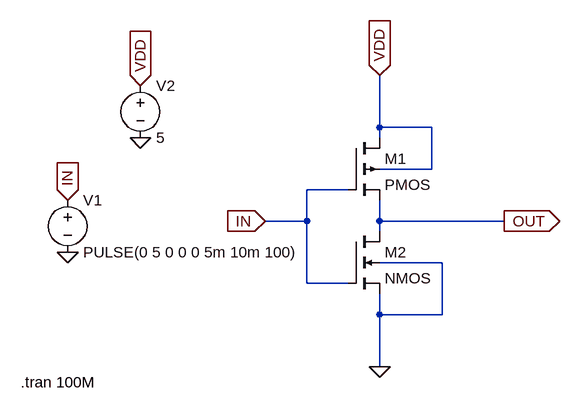
[diagram p0: schematic Schematic.asc]
Schematic.asc, the LTspice schematic file:
Version 4
SHEET 1 880 680
WIRE 208 16 208 -64
WIRE 288 16 208 16
WIRE 208 32 208 16
WIRE 288 80 288 16
WIRE 288 80 208 80
WIRE 160 112 96 112
WIRE 96 160 96 112
WIRE 96 160 32 160
WIRE 208 160 208 128
WIRE 400 160 208 160
WIRE 208 176 208 160
WIRE 304 224 208 224
WIRE 96 256 96 160
WIRE 160 256 96 256
WIRE 208 304 208 272
WIRE 304 304 304 224
WIRE 304 304 208 304
WIRE 208 384 208 304
FLAG 208 384 0
FLAG 32 160 IN
IOPIN 32 160 In
FLAG 400 160 OUT
IOPIN 400 160 Out
FLAG 208 -64 VDD
IOPIN 208 -64 In
FLAG -160 -48 VDD
IOPIN -160 -48 In
FLAG -272 128 IN
IOPIN -272 128 In
FLAG -160 32 0
FLAG -272 208 0
SYMBOL pmos4 160 32 R0
SYMATTR InstName M1
SYMBOL nmos4 160 176 R0
SYMATTR InstName M2
SYMBOL voltage -272 112 R0
WINDOW 123 0 0 Left 0
WINDOW 39 0 0 Left 0
SYMATTR InstName V1
SYMATTR Value PULSE(0 5 0 0 0 5m 10m 100)
SYMBOL voltage -160 -64 R0
WINDOW 123 0 0 Left 0
WINDOW 39 0 0 Left 0
SYMATTR InstName V2
SYMATTR Value 5
TEXT -344 408 Left 2 !.tran 100M

The netlist it stands for:
* Schematic.asc
M1 VDD IN OUT VDD PMOS
M2 OUT IN 0 0 NMOS
V1 IN 0 PULSE(0 5 0 0 0 5m 10m 100)
V2 VDD 0 5
.model NMOS NMOS
.model PMOS PMOS
.lib standard.mos
.tran 100M
.backanno
.end